# EAGLE schematic Termo3 (EAGLE 6.2)
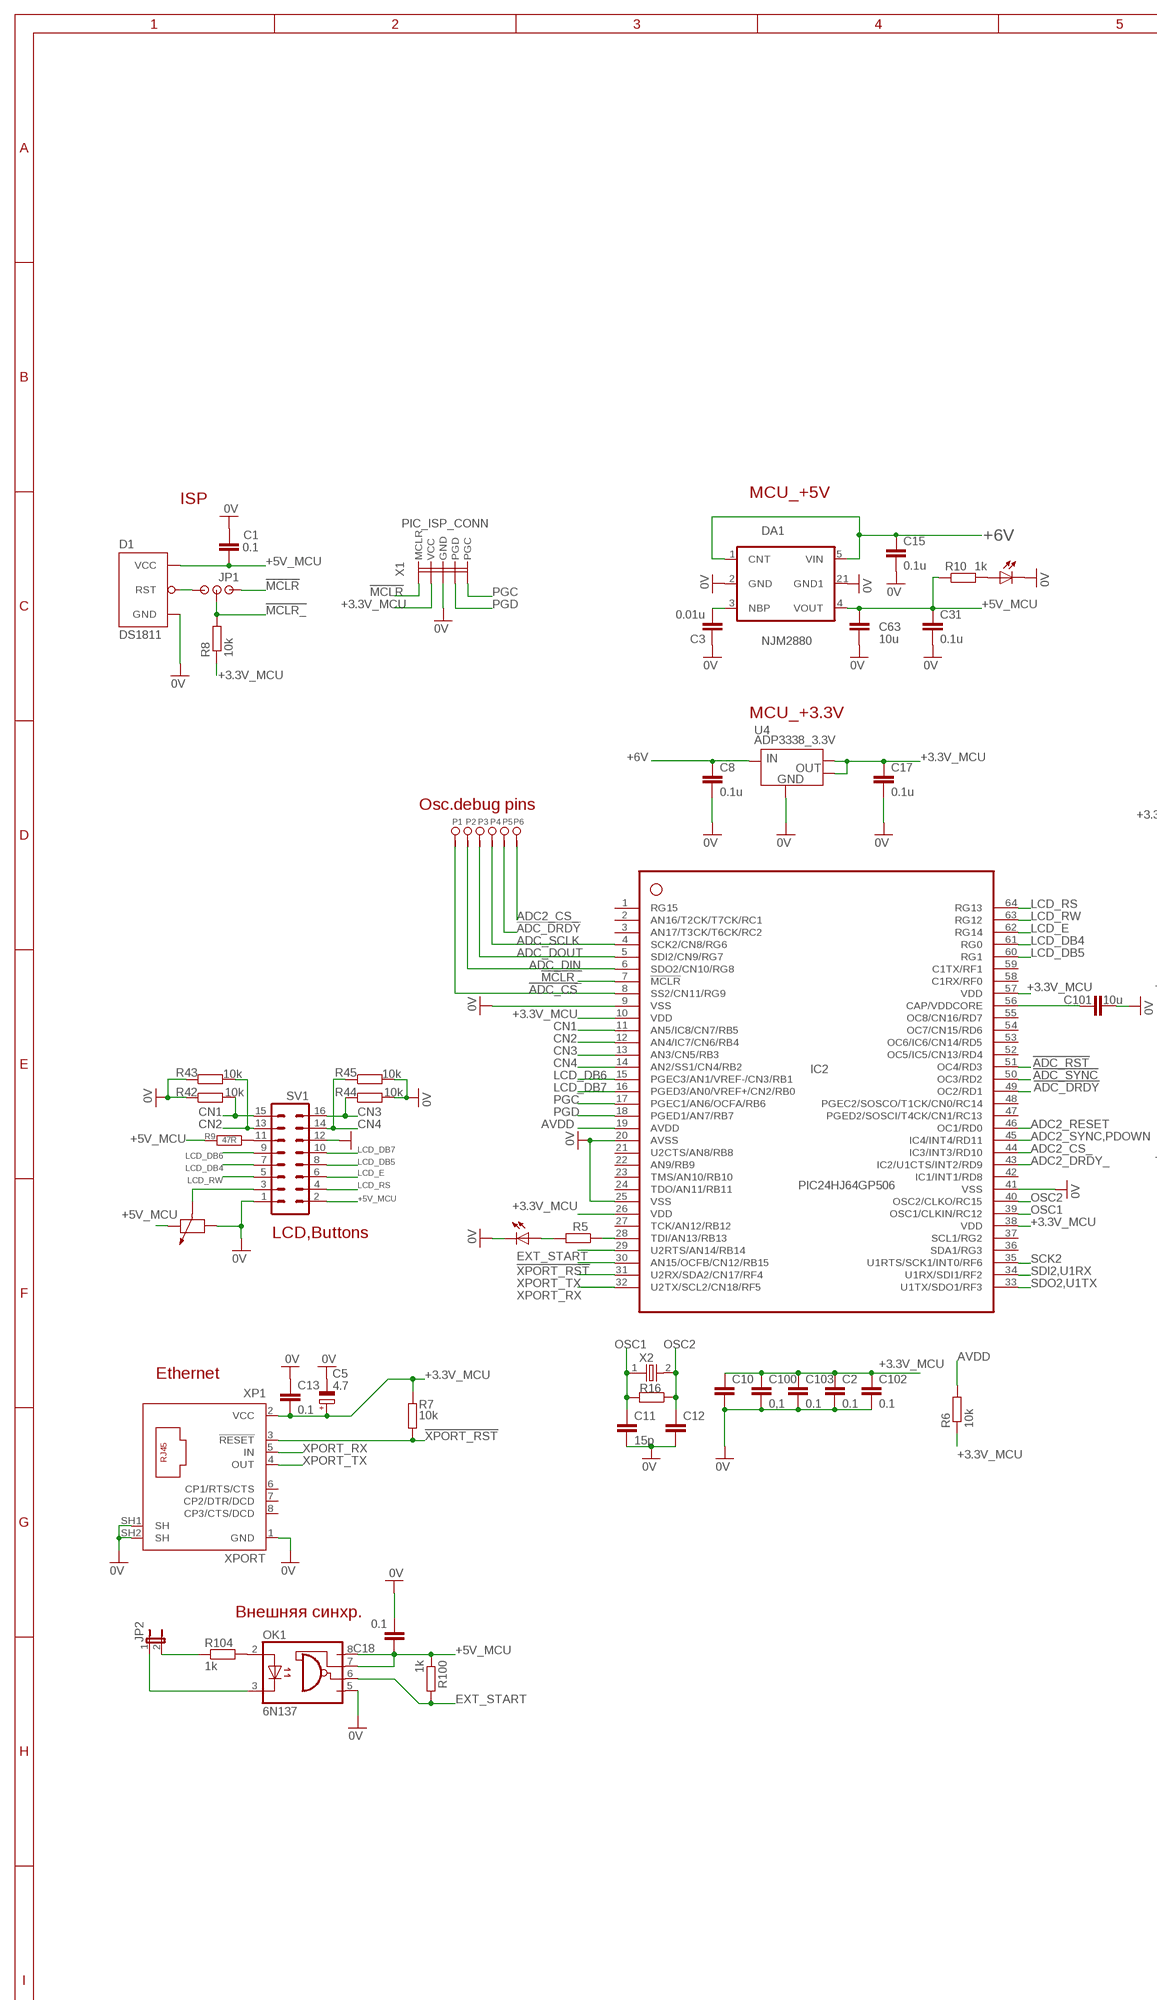
[diagram p0: schematic, sheet 1, part 1 of 2]
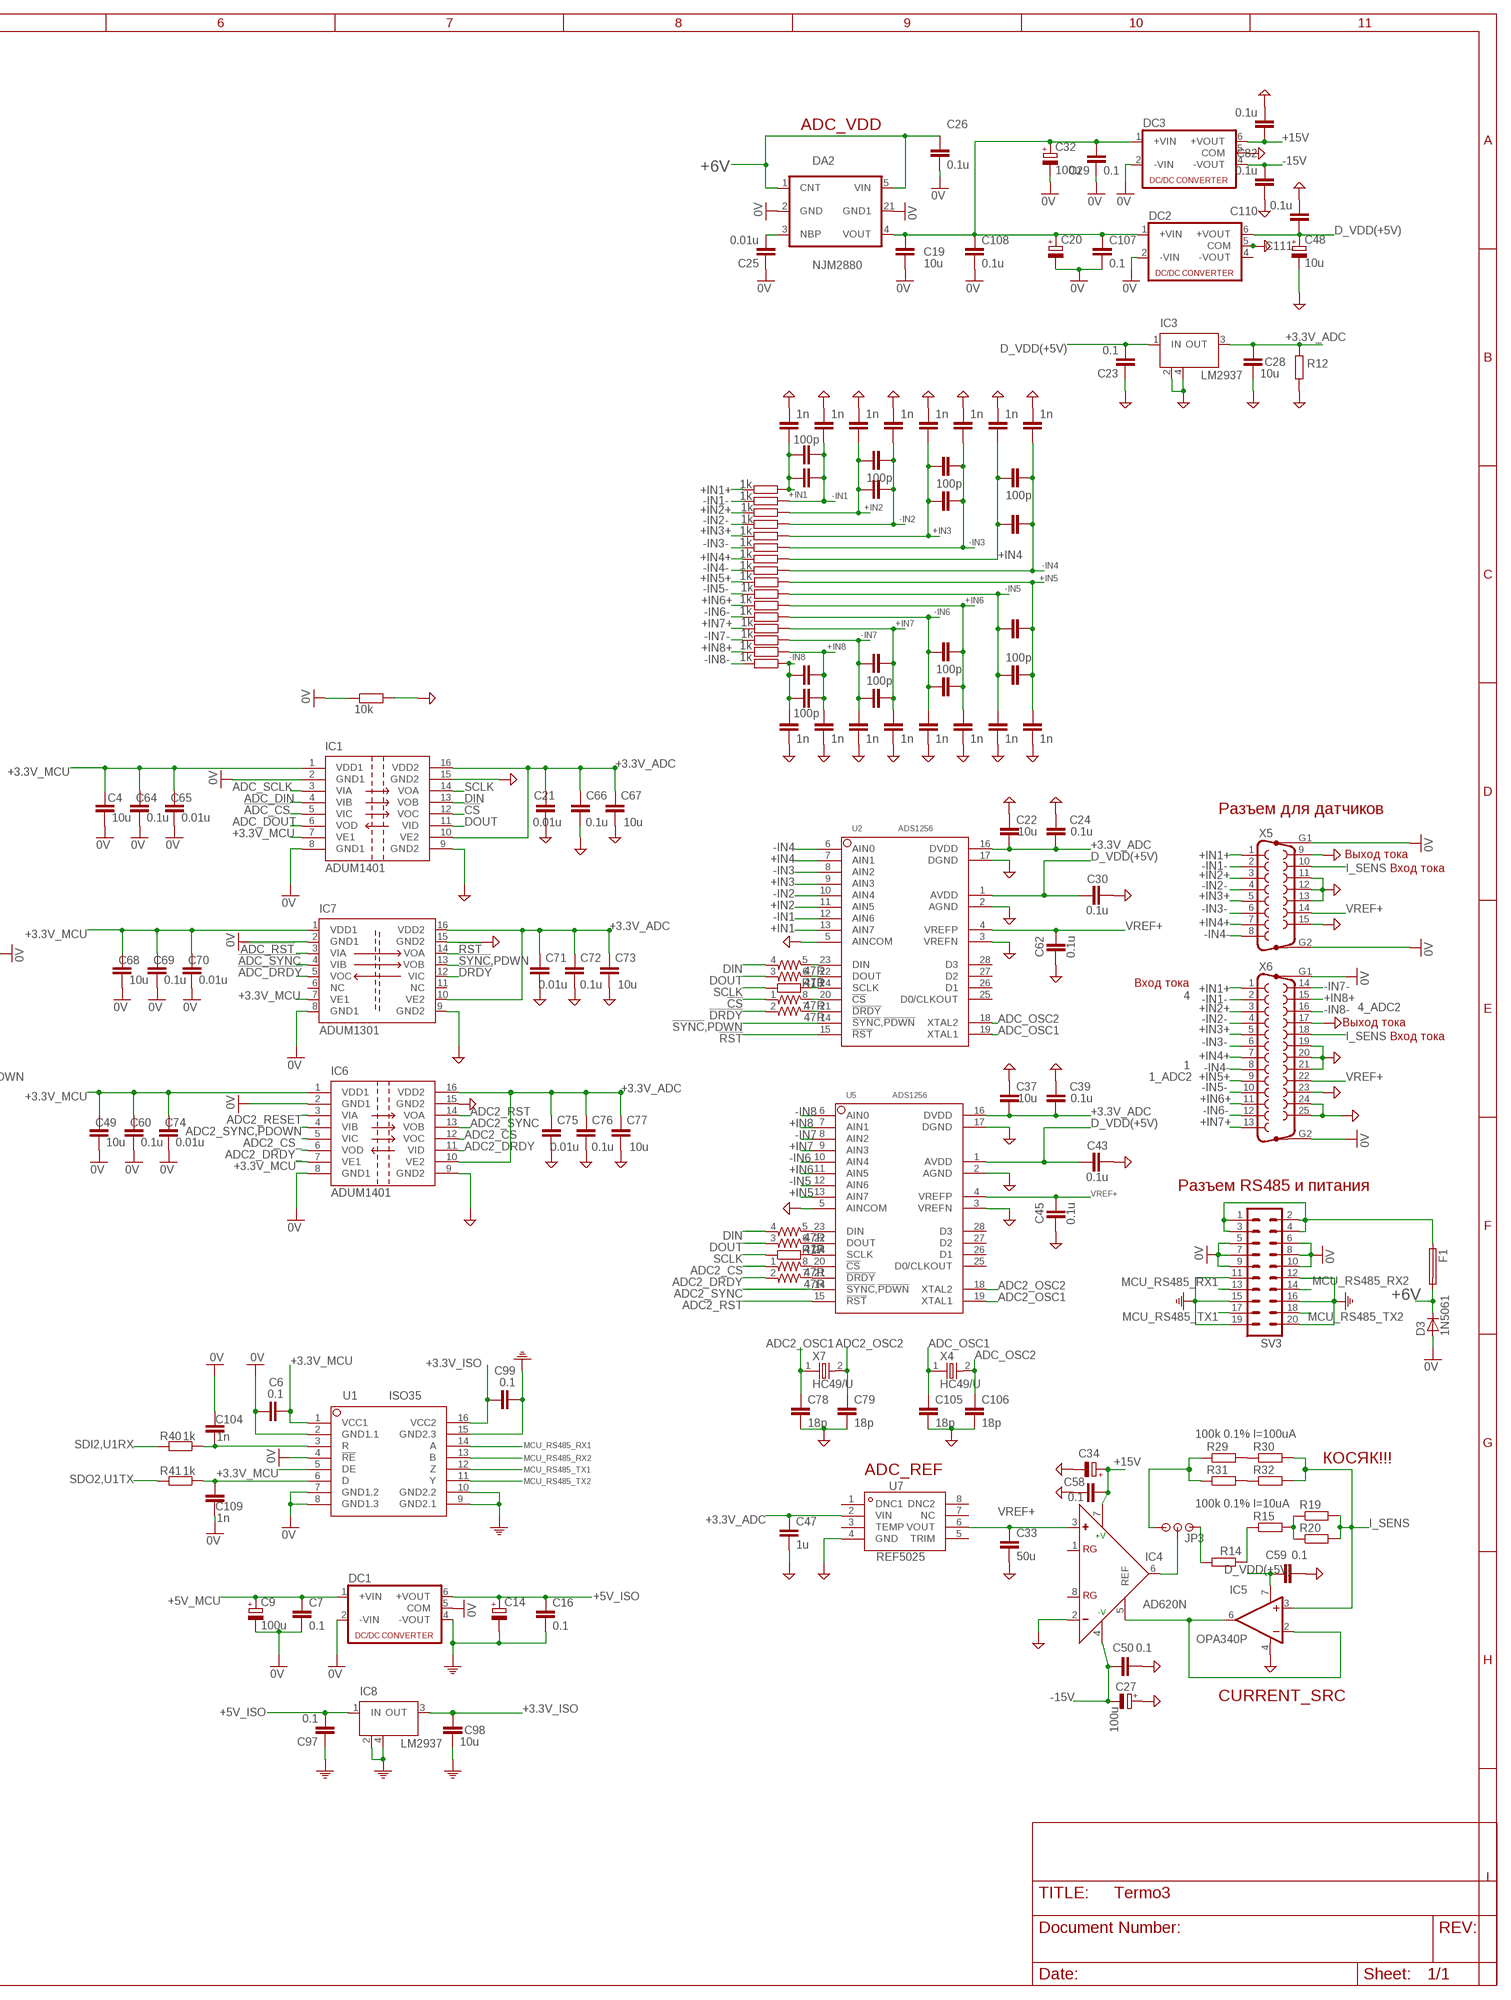
[diagram p1: schematic, sheet 1, part 2 of 2]

## Parts
C1  0.1  C0805  [C0805D]
C2  0.1  C0805  [C0805D]
C3  0.01u  C0805  [C0805D]
C4  10u  C0805  [C0805D]
C5  4.7  C100MFX25V  [C100MILX6X12]
C6  0.1  C0805  [C0805D]
C7  0.1  C0805  [C0805D]
C8  0.1u  C0805  [C0805D]
C9  100u  C100MFX25V  [C100MILX6X12]
C10  C0805  [C0805D]
C11  15p  C0805  [C0805D]
C12  C0805  [C0805D]
C13  0.1  C0805  [C0805D]
C14  C100MFX25V  [C100MILX6X12]
C15  0.1u  C0805  [C0805D]
C16  0.1  C0805  [C0805D]
C17  0.1u  C0805  [C0805D]
C18  0.1  C0805  [C0805D]
C19  10u  C0805  [C0805D]
C20  C100MFX25V  [C100MILX6X12]
C21  0.01u  C0805  [C0805D]
C22  10u  C0805  [C0805D]
C23  0.1  C0805  [C0805D]
C24  0.1u  C0805  [C0805D]
C25  0.01u  C0805  [C0805D]
C26  0.1u  C0805  [C0805D]
C27  100u  C100MFX25V  [C100MILX6X12]
C28  10u  C0805  [C0805D]
C29  0.1  C0805  [C0805D]
C30  0.1u  C0805  [C0805D]
C31  0.1u  C0805  [C0805D]
C32  100u  C100MFX25V  [C100MILX6X12]
C33  50u  C0805  [C0805D]
C34  C100MFX25V  [C100MILX6X12]
C35  100p  C0805  [C0805D]
C36  100p  C0805  [C0805D]
C37  10u  C0805  [C0805D]
C38  100p  C0805  [C0805D]
C39  0.1u  C0805  [C0805D]
C40  100p  C0805  [C0805D]
C41  1n  C0805  [C0805D]
C42  1n  C0805  [C0805D]
C43  0.1u  C0805  [C0805D]
C44  1n  C0805  [C0805D]
C45  0.1u  C0805  [C0805D]
C46  1n  C0805  [C0805D]
C47  1u  C0805  [C0805D]
C48  10u  C100MFX25V  [C100MILX6X12]
C49  10u  C0805  [C0805D]
C50  0.1  C0805  [C0805D]
C51  1n  C0805  [C0805D]
C52  1n  C0805  [C0805D]
C53  1n  C0805  [C0805D]
C54  1n  C0805  [C0805D]
C55  1n  C0805  [C0805D]
C56  1n  C0805  [C0805D]
C57  1n  C0805  [C0805D]
C58  0.1  C0805  [C0805D]
C59  0.1  C0805  [C0805D]
C60  0.1u  C0805  [C0805D]
C61  1n  C0805  [C0805D]
C62  0.1u  C0805  [C0805D]
C63  10u  C0805  [C0805D]
C64  0.1u  C0805  [C0805D]
C65  0.01u  C0805  [C0805D]
C66  0.1u  C0805  [C0805D]
C67  10u  C0805  [C0805D]
C68  10u  C0805  [C0805D]
C69  0.1u  C0805  [C0805D]
C70  0.01u  C0805  [C0805D]
C71  0.01u  C0805  [C0805D]
C72  0.1u  C0805  [C0805D]
C73  10u  C0805  [C0805D]
C74  0.01u  C0805  [C0805D]
C75  0.01u  C0805  [C0805D]
C76  0.1u  C0805  [C0805D]
C77  10u  C0805  [C0805D]
C78  18p  C0805  [C0805D]
C79  18p  C0805  [C0805D]
C80  1n  C0805  [C0805D]
C81  1n  C0805  [C0805D]
C82  0.1u  C0805  [C0805D]
C83  1n  C0805  [C0805D]
C84  1n  C0805  [C0805D]
C85  1n  C0805  [C0805D]
C86  1n  C0805  [C0805D]
C87  1n  C0805  [C0805D]
C88  1n  C0805  [C0805D]
C89  1n  C0805  [C0805D]
C90  100p  C0805  [C0805D]
C91  1n  C0805  [C0805D]
C92  1n  C0805  [C0805D]
C93  1n  C0805  [C0805D]
C94  100p  C0805  [C0805D]
C95  100p  C0805  [C0805D]
C96  100p  C0805  [C0805D]
C97  0.1  C0805  [C0805D]
C98  10u  C0805  [C0805D]
C99  0.1  C0805  [C0805D]
C100  0,1  C0805  [C0805D]
C101  10u  C0805  [C0805D]
C102  0.1  C0805  [C0805D]
C103  0.1  C0805  [C0805D]
C104  1n  C0805  [C0805D]
C105  18p  C0805  [C0805D]
C106  18p  C0805  [C0805D]
C107  0.1  C0805  [C0805D]
C108  0.1u  C0805  [C0805D]
C109  1n  C0805  [C0805D]
C110  0.1u  C0805  [C0805D]
C111  0.1u  C0805  [C0805D]
D1  DS1811  [TO92-60]
D3  1N5061  [DO41-10]
DA1  NJM2880  [SOT89-5]
DA2  NJM2880  [SOT89-5]
DC1  NMA  [NMA]
DC2  NMA  [NMA]
DC3  NMA  [NMA]
F1  TE5  [TE5]
HL2  LED3MM  [LED3MM]
HL6  LED3MM  [LED3MM]
IC1  ADUM1401  [SO16W]
IC2  PIC24HJ64GP506  [TQFP64-10X10]
IC3  LM2937  [SOT223]
IC4  AD620N  [DIL08]
IC5  OPA340P  [DIL08]
IC6  ADUM1401  [SO16W]
IC7  ADUM1301  [SO-16W]
IC8  LM2937  [SOT223]
JP1  JP3PIN  [PLC-3PIN]
JP2  JP1E  [JP1]
JP3  JP3PIN  [PLC-3PIN]
OK1  6N137  [DIL08]
P1  1_PIN_CON  [1_PIN_CON]
P2  1_PIN_CON  [1_PIN_CON]
P3  1_PIN_CON  [1_PIN_CON]
P4  1_PIN_CON  [1_PIN_CON]
P5  1_PIN_CON  [1_PIN_CON]
P6  1_PIN_CON  [1_PIN_CON]
POT1  RTRIM3329H  [RTRIM3329H]
R5  51R  R0805  [R0805D]
R6  10k  R0805  [R0805D]
R7  10k  R0805  [R0805D]
R8  10k  R0805  [R0805D]
R9  47R  MLT025"  [0207/10]
R10  1k  R0805  [R0805D]
R11  10k  R0805  [R0805D]
R12  1k  R0805  [R0805D]
R13  51R  R0805  [R0805D]
R14  MLT025"  [0207/10]
R15  100k 0.1% I=10uA  MLT025"  [0207/10]
R16  1M  R0805  [R0805D]
R17  51R  R0805  [R0805D]
R18  1k  R0805  [R0805D]
R19  MLT025"  [0207/10]
R20  MLT025"  [0207/10]
R21  1k  R0805  [R0805D]
R22  1k  R0805  [R0805D]
R23  1k  R0805  [R0805D]
R24  1k  R0805  [R0805D]
R25  1k  R0805  [R0805D]
R26  1k  R0805  [R0805D]
R27  1k  R0805  [R0805D]
R28  1k  R0805  [R0805D]
R29  100k 0.1% I=100uA  MLT025"  [0207/10]
R30  MLT025"  [0207/10]
R31  MLT025"  [0207/10]
R32  MLT025"  [0207/10]
R33  1k  R0805  [R0805D]
R34  1k  R0805  [R0805D]
R35  1k  R0805  [R0805D]
R36  1k  R0805  [R0805D]
R37  1k  R0805  [R0805D]
R38  1k  R0805  [R0805D]
R39  1k  R0805  [R0805D]
R40  1k  R0805  [R0805D]
R41  1k  R0805  [R0805D]
R42  10k  R0805  [R0805D]
R43  10k  R0805  [R0805D]
R44  10k  R0805  [R0805D]
R45  10k  R0805  [R0805D]
R100  1k  R0805  [R0805D]
R104  1k  R0805  [R0805D]
RN1  47R  742-8_SNS  [742-8NS]
RN2  47R  742-8_SNS  [742-8NS]
SV1  ML16  [ML16]
SV3  ML20L  [ML20L]
U1  ISO35  [ISO35_SOIC16]
U2  ADS1256  [PCM2705-TSSOP28]
U4  ADP3338_3.3V  [SOT223]
U5  ADS1256  [PCM2705-TSSOP28]
U7  REF5025  [SO08]
X1  PIC_ISP_CONN  [PLC-5PIN]
X2  10MEG  HC49/U  [HC49U-V]
X4  HC49/U  [HC49U-V]
X5  F15HP  [F15HP]
X6  F25HP  [F25HP]
X7  HC49/U  [HC49U-V]
XP1  XPORT  [XPORT]

## Nets
0V: C1.2 C2.2 C3.1 C4.2 C5.MINUS(-) C6.1 C7.2 C8.2 C9.MINUS(-) C10.2 C11.2 C12.2 C13.1 C15.2 C17.2 C18.2 C19.1 C20.MINUS(-) C25.1 C26.2 C29.1 C31.2 C32.MINUS(-) C49.2 C60.2 C63.1 C64.2 C65.2 C68.2 C69.2 C70.2 C74.2 C100.2 C101.2 C102.2 C103.2 C104.1 C107.2 C108.2 C109.2 D1.3(GND) D3.A DA1.2(GND) DA1.21(GND1) DA2.2(GND) DA2.21(GND1) DC1.2(-VIN) DC1.5(COM) DC2.2(-VIN) DC3.2(-VIN) HL2.K(C) HL6.K(C) IC1.2(GND1) IC1.8(GND1) IC2.9(VSS) IC2.20(AVSS) IC2.25(VSS) IC2.41(VSS) IC6.2(GND1) IC6.8(GND1) IC7.2(GND1) IC7.8(GND1) OK1.5(GND) POT1.1 R11.P$1 R42.P$1 R43.P$1 R44.P$2 R45.P$2 SV1.1 SV1.12 SV3.5 SV3.6 SV3.7 SV3.8 SV3.9 SV3.10 U1.2(GND1.1) U1.4(!RE) U1.7(GND1.2) U1.8(GND1.3) U4.1 X1.P$3(GND) X5.G1 X5.G2 X6.G1 X6.G2 XP1.1(GND) XP1.SH1(SH) XP1.SH2(SH)
!ADC_CS: IC1.5(VIC) IC2.8(SS2/CN11/RG9) P1.P$1
!ADC_DRDY: IC2.49(OC2/RD1) IC7.5(VOC) P5.P$1
!ADC_RST: IC2.51(OC4/RD3) IC7.3(VIA)
!ADC_SYNC: IC2.50(OC3/RD2) IC7.4(VIB)
!CS: IC1.12(VOC) RN1.1
!DRDY: IC7.12(VIC) RN1.2
!MCLR: JP1.P$1 X1.P$1(MCLR)
!MCLR_: IC2.7(!MCLR) JP1.P$2 R8.P$2
!RST: IC7.14(VOA) U2.15(!RST)
!SYNC,PDWN: IC7.13(VOB) U2.14(!SYNC,!PDWN)
!XPORT_RST: IC2.30(AN15/OCFB/CN12/RB15) R7.P$2 XP1.3(!RESET)
+3.3V_ADC: C21.2 C22.2 C24.1 C28.2 C37.2 C39.1 C47.1 C66.2 C67.2 C71.2 C72.2 C73.2 C75.2 C76.2 C77.2 IC1.10(VE2) IC1.16(VDD2) IC3.3(OUT) IC6.10(VE2) IC6.16(VDD2) IC7.10(VE2) IC7.16(VDD2) R12.P$2 U2.16(DVDD) U5.16(DVDD) U7.2(VIN)
+3.3V_ISO: C98.2 C99.1 IC8.3(OUT) U1.16(VCC2)
+3.3V_MCU: C2.1 C4.1 C5.PLUS(+) C6.2 C10.1 C13.2 C17.1 C49.1 C60.1 C64.1 C65.1 C68.1 C69.1 C70.1 C74.1 C100.1 C102.1 C103.1 IC1.1(VDD1) IC1.7(VE1) IC2.10(VDD) IC2.26(VDD) IC2.38(VDD) IC2.57(VDD) IC6.1(VDD1) IC6.7(VE1) IC7.1(VDD1) IC7.7(VE1) R6.P$1 R7.P$1 R8.P$1 U1.1(VCC1) U1.5(DE) U4.2 U4.4(2.) X1.P$2(VCC) XP1.2(VCC)
+5V_ISO: C14.PLUS(+) C16.1 C97.2 DC1.6(+VOUT) IC8.1(IN)
+5V_MCU: C1.1 C7.1 C9.PLUS(+) C18.1 C31.1 C63.2 D1.2(VCC) DA1.4(VOUT) DC1.1(+VIN) OK1.7(VE) OK1.8(VCC) POT1.2 R9.2 R10.P$1 R100.P$1 SV1.2
+6V: C8.1 C15.1 C26.1 D3.C DA1.1(CNT) DA1.5(VIN) DA2.1(CNT) DA2.5(VIN) F1.2 U4.3
+15V: C34.PLUS(+) C58.2 C82.1 DC3.6(+VOUT) IC4.7(+V)
+IN1: C35.1 C41.1 C51.1 R22.P$1 U2.13(AIN7)
+IN1+: R22.P$2 X5.1 X6.1
+IN2: C40.1 C46.1 C57.1 R28.P$1 U2.11(AIN5)
+IN2+: R28.P$2 X5.3 X6.3
+IN3: C38.1 C44.1 C55.1 R26.P$1 U2.9(AIN3)
+IN3+: R26.P$2 X5.5 X6.5
+IN4: C36.1 C42.1 C53.1 R24.P$1 U2.7(AIN1)
+IN4+: R24.P$2 X5.7 X6.7
+IN5: C86.1 C91.2 C94.2 R35.P$1 U5.13(AIN7)
+IN5+: R35.P$2 X6.9
+IN6: C84.1 C92.2 C95.2 R33.P$1 U5.11(AIN5)
+IN6+: R33.P$2 X6.11
+IN7: C81.1 C89.2 C96.2 R18.P$1 U5.9(AIN3)
+IN7+: R18.P$2 X6.13
+IN8: C87.1 C90.2 C93.2 R38.P$1 U5.7(AIN1)
+IN8+: R38.P$2 X6.15
-15V: C27.MINUS(-) C50.2 C110.2 DC3.4(-VOUT) IC4.4(-V)
-IN1: C35.2 C41.2 C61.1 R21.P$1 U2.12(AIN6)
-IN1-: R21.P$2 X5.2 X6.2
-IN2: C40.2 C46.2 C56.1 R27.P$1 U2.10(AIN4)
-IN2-: R27.P$2 X5.4 X6.4
-IN3: C38.2 C44.2 C54.1 R25.P$1 U2.8(AIN2)
-IN3-: R25.P$2 X5.6 X6.6
-IN4: C36.2 C42.2 C52.1 R23.P$1 U2.6(AIN0)
-IN4-: R23.P$2 X5.8 X6.8
-IN5: C85.1 C91.1 C94.1 R34.P$1 U5.12(AIN6)
-IN5-: R34.P$2 X6.10
-IN6: C83.1 C92.1 C95.1 R36.P$1 U5.10(AIN4)
-IN6-: R36.P$2 X6.12
-IN7: C80.1 C89.1 C96.1 R37.P$1 U5.8(AIN2)
-IN7-: R37.P$2 X6.14
-IN8: C88.1 C90.1 C93.1 R39.P$1 U5.6(AIN0)
-IN8-: R39.P$2 X6.16
ADC2_CS: IC6.12(VOC) RN2.1
ADC2_CS_: IC2.44(IC3/INT3/RD10) IC6.5(VIC) P6.P$1
ADC2_DRDY: IC6.11(VID) RN2.2
ADC2_DRDY_: IC2.43(IC2/U1CTS/INT2/RD9) IC6.6(VOD)
ADC2_OSC1: C78.1 U5.19(XTAL1) X7.1
ADC2_OSC2: C79.1 U5.18(XTAL2) X7.2
ADC2_RESET: IC2.46(OC1/RD0) IC6.3(VIA)
ADC2_RST: IC6.14(VOA) U5.15(!RST)
ADC2_SYNC: IC6.13(VOB) U5.14(!SYNC,!PDWN)
ADC2_SYNC,PDOWN: IC2.45(IC4/INT4/RD11) IC6.4(VIB)
ADC_AVDD: C19.2 C20.PLUS(+) C29.2 C32.PLUS(+) C107.1 C108.1 DA2.4(VOUT) DC2.1(+VIN) DC3.1(+VIN)
ADC_DIN: IC1.4(VIB) IC2.6(SDO2/CN10/RG8) P2.P$1
ADC_DOUT: IC1.6(VOD) IC2.5(SDI2/CN9/RG7) P3.P$1
ADC_OSC1: C105.1 U2.19(XTAL1) X4.1
ADC_OSC2: C106.1 U2.18(XTAL2) X4.2
ADC_SCLK: IC1.3(VIA) IC2.4(SCK2/CN8/RG6) P4.P$1
AVDD: IC2.19(AVDD) R6.P$2
CN1: IC2.11(AN5/IC8/CN7/RB5) R42.P$2 SV1.15
CN2: IC2.12(AN4/IC7/CN6/RB4) R43.P$2 SV1.13
CN3: IC2.13(AN3/CN5/RB3) R44.P$1 SV1.16
CN4: IC2.14(AN2/SS1/CN4/RB2) R45.P$1 SV1.14
D_VDD(+5V): C23.2 C30.1 C43.1 C48.PLUS(+) C59.1 C111.1 DC2.6(+VOUT) IC3.1(IN) IC5.7(V+) U2.1(AVDD) U5.1(AVDD)
DGND: C21.1 C22.1 C23.1 C24.2 C27.PLUS(+) C28.1 C30.2 C33.2 C34.MINUS(-) C37.1 C39.2 C43.2 C45.1 C47.2 C48.MINUS(-) C50.1 C51.2 C52.2 C53.2 C54.2 C55.2 C56.2 C57.2 C58.1 C59.2 C61.2 C62.1 C66.1 C67.1 C71.1 C72.1 C73.1 C75.1 C76.1 C77.1 C78.2 C79.2 C80.2 C81.2 C82.2 C83.2 C84.2 C85.2 C86.2 C87.2 C88.2 C105.2 C106.2 C110.1 C111.2 DC2.5(COM) DC3.5(COM) IC1.9(GND2) IC1.15(GND2) IC3.2(GND) IC3.4(GND) IC4.2(-) IC5.4(V-) IC6.9(GND2) IC6.15(GND2) IC7.9(GND2) IC7.15(GND2) R11.P$2 R12.P$1 U2.2(AGND) U2.3(VREFN) U2.5(AINCOM) U2.17(DGND) U5.2(AGND) U5.3(VREFN) U5.5(AINCOM) U5.17(DGND) U7.4(GND) X5.9 X5.11 X5.12 X5.13 X5.15 X6.17 X6.19 X6.20 X6.21 X6.23 X6.24 X6.25
DIN: IC1.13(VOB) RN1.4 RN2.4
DOUT: IC1.11(VID) RN1.3 RN2.3
EXT_START: IC2.29(U2RTS/AN14/RB14) OK1.6(VO) R100.P$2
I_SENS: IC5.3(+IN) R19.2 R20.2 R30.2 R32.2 X5.10 X6.18
LCD_DB4: IC2.61(RG0) SV1.7
LCD_DB5: IC2.60(RG1) SV1.8
LCD_DB6: IC2.15(PGEC3/AN1/VREF-/CN3/RB1) SV1.9
LCD_DB7: IC2.16(PGED3/AN0/VREF+/CN2/RB0) SV1.10
LCD_E: IC2.62(RG14) SV1.6
LCD_RS: IC2.64(RG13) SV1.4
LCD_RW: IC2.63(RG12) SV1.5
MCU_RS485_RX1: SV3.13 U1.14(A)
MCU_RS485_RX2: SV3.14 U1.13(B)
MCU_RS485_TX1: SV3.17 U1.12(Z)
MCU_RS485_TX2: SV3.18 U1.11(Y)
N$1: C101.1 IC2.56(CAP/VDDCORE)
N$2: D1.1(RST) JP1.P$3
N$3: RN1.8 U2.20(!CS)
N$4: RN1.7 U2.21(!DRDY)
N$5: RN1.6 U2.22(DOUT)
N$6: RN1.5 U2.23(DIN)
N$7: R13.P$2 U2.24(SCLK)
N$8: C3.2 DA1.3(NBP)
N$9: POT1.3 SV1.3
N$10: RN2.8 U5.20(!CS)
N$12: IC4.5(REF) IC5.2(-IN) IC5.6(OUT)
N$13: F1.1 SV3.1 SV3.2 SV3.3 SV3.4
N$14: C25.2 DA2.3(NBP)
N$15: RN2.7 U5.21(!DRDY)
N$16: RN2.6 U5.22(DOUT)
N$17: IC4.6(OUT) JP3.P$2
N$18: R9.1 SV1.11
N$19: HL6.A R10.P$2
N$20: IC2.28(TDI/AN13/RB13) R5.P$1
N$21: HL2.A R5.P$2
N$24: JP2.1 OK1.3(C)
N$25: RN2.5 U5.23(DIN)
N$27: R17.P$2 U5.24(SCLK)
N$33: R29.2 R30.1
N$34: R31.2 R32.1
N$35: JP3.P$3 R29.1 R31.1
N$37: JP3.P$1 R14.2
N$38: OK1.2(A) R104.P$2
N$39: JP2.2 R104.P$1
N$44: R14.1 R15.1
N$46: R15.2 R19.1 R20.1
N$56: C104.2 R40.P$1 U1.3(R)
N$57: C109.1 R41.P$1 U1.6(D)
OSC1: C11.1 IC2.39(OSC1/CLKIN/RC12) R16.P$2 X2.1
OSC2: C12.1 IC2.40(OSC2/CLKO/RC15) R16.P$1 X2.2
PE: C14.MINUS(-) C16.2 C97.1 C98.1 C99.2 DC1.4(-VOUT) IC8.2(GND) IC8.4(GND) SV3.11 SV3.12 SV3.15 SV3.16 SV3.19 SV3.20 U1.9(GND2.1) U1.10(GND2.2) U1.15(GND2.3)
PGC: IC2.17(PGEC1/AN6/OCFA/RB6) X1.P$5(PGC)
PGD: IC2.18(PGED1/AN7/RB7) X1.P$4(PGD)
SCK2: IC2.35(U1RTS/SCK1/INT0/RF6)
SCLK: IC1.14(VOA) R13.P$1 R17.P$1
SDI2,U1RX: IC2.34(U1RX/SDI1/RF2) R40.P$2
SDO2,U1TX: IC2.33(U1TX/SDO1/RF3) R41.P$2
VREF+: C33.1 C45.2 C62.2 IC4.3(+) U2.4(VREFP) U5.4(VREFP) U7.6(VOUT) X5.14 X6.22
XPORT_RX: IC2.32(U2TX/SCL2/CN18/RF5) XP1.5(IN)
XPORT_TX: IC2.31(U2RX/SDA2/CN17/RF4) XP1.4(OUT)
Unconnected: DC2.4(-VOUT) IC2.1(RG15) IC2.2(AN16/T2CK/T7CK/RC1) IC2.3(AN17/T3CK/T6CK/RC2) IC2.21(U2CTS/AN8/RB8) IC2.22(AN9/RB9) IC2.23(TMS/AN10/RB10) IC2.24(TDO/AN11/RB11) IC2.27(TCK/AN12/RB12) IC2.36(SDA1/RG3) IC2.37(SCL1/RG2) IC2.42(IC1/INT1/RD8) IC2.47(PGED2/SOSCI/T4CK/CN1/RC13) IC2.48(PGEC2/SOSCO/T1CK/CN0/RC14) IC2.52(OC5/IC5/CN13/RD4) IC2.53(OC6/IC6/CN14/RD5) IC2.54(OC7/CN15/RD6) IC2.55(OC8/CN16/RD7) IC2.58(C1RX/RF0) IC2.59(C1TX/RF1) IC4.1(RG) IC4.8(RG) IC7.6(NC) IC7.11(NC) U2.25(D0/CLKOUT) U2.26(D1) U2.27(D2) U2.28(D3) U5.25(D0/CLKOUT) U5.26(D1) U5.27(D2) U5.28(D3) U7.1(DNC1) U7.3(TEMP) U7.5(TRIM) U7.7(NC) U7.8(DNC2) XP1.6(CP1/RTS/CTS) XP1.7(CP2/DTR/DCD) XP1.8(CP3/CTS/DCD)

## Notes on the sheet
- ADC_VDD
- MCU_+5V
- ISP
- MCU_+3.3V
- Osc.debug pins
- Разъем для датчиков
- Выход тока
- Вход тока
- Вход тока
- 4
- 4_ADC2
- Выход тока
- Вход тока
- 1
- 1_ADC2
- LCD,Buttons
- Разъем RS485 и питания
- Ethernet
- КОСЯК!!!
- ADC_REF
- Внешняя синхр.
- CURRENT_SRC

## Library data of the parts
C1-C4 C6-C8 C10-C13 C15-C19 C21-C26 C28-C31 C33 C35-C47 C49-C111 = den:C0805
C5 C9 C14 C20 C27 C32 C34 C48 = den:C100MFX25V
D1 = den:DS1811
D3 = den:1N5061
DA1 DA2 = den:NJM2880
DC1-DC3 = dc-dc-converter:NMA: DC-DC CONVERTER; MF: C & D TECHNOLOGIES, INC; MPN: NMA0515SC; OC_FARNELL: 1021434; OC_NEWARK: 61K3064
F1 = fuse:TE5: FUSE Wickmann; OC_FARNELL: unknown; OC_NEWARK: unknown
HL2 HL6 = den:LED3MM
IC1 IC6 = Dmitry:ADUM1401
IC2 = Dmitry:PIC24HJ64GP506: PIC24HJ64GP506 edit this description Auto generated by make-symbol-device-package-bsdl.ulp Rev. 25 Source: PIC24HJ64GP506.bsd; MPN: PIC24HJ64GP506A-I/PT; OC_FARNELL: 1146551; OC_NEWARK: 45P4882
IC3 IC8 = Dmitry:LM2937: 3-Terminal Positive Regulators
IC4 = analog-devices:AD620: Low Cost, Low Power, Instrumentation Amplifier Source: http://www.analog.com/UploadedFiles/Data_Sheets/37793330023930AD620_e.pdf; MF: ALTERA CORPORATION; MPN: AD620AN; OC_FARNELL: 1523782; OC_NEWARK: 05F7108
IC5 = burr-brown:OPA340: Rail-to-Rail Operational Amplifiers Single-Supply, MicroAmplifier(TM) Series; MPN: OPA340PA; OC_FARNELL: 1097413; OC_NEWARK: 97K6826
IC7 = Dmitry:ADUM1301: Triple-Channel Digital Isolators Source: http://www.analog.com/static/imported-files/data_sheets/ADuM1300_1301.pdf; MPN: ADUM1301BRWZ; OC_FARNELL: 1465623; OC_NEWARK: 19M0757
JP1 JP3 = den:JP3PIN
JP2 = jumper:JP1E: JUMPER
OK1 = optocoupler:6N137: MOTOROLA OPTO COUPLER; MPN: 6N137; OC_FARNELL: 1328376; OC_NEWARK: 52M1895
P1-P6 = Dmitry:1_PIN_CON
POT1 = Dmitry:RTRIM3329H
R5-R8 R10-R13 R16-R18 R21-R28 R33-R45 R100 R104 = den:R0805
R9 R14 R15 R19 R20 R29-R32 = den:MLT025
RN1 RN2 = resistor-array:742-8_S: CTS 742 Series 8 Terminations, 4 Resistors
SV1 = con-harting-ml:ML16: HARTING; OC_FARNELL: unknown; OC_NEWARK: unknown
SV3 = con-harting-ml:ML20: HARTING; OC_FARNELL: unknown; OC_NEWARK: unknown
U1 = Dmitry:ISO35: RS485
U2 U5 = Dmitry:ADS1256: TI ADS1256 - 24 bit delta sigma ADC TSSOP28 PAC
U4 = Dmitry:ADP3338_3.3V
U7 = Dmitry:REF5025
X1 = den:PIC_ISP_CONN
X2 X4 X7 = den:HC49/U
X5 = con-subd:F15HP: SUB-D; OC_FARNELL: unknown; OC_NEWARK: unknown
X6 = con-subd:F25HP: SUB-D; OC_FARNELL: unknown; OC_NEWARK: unknown
XP1 = lantronix:XPORT: Serial to 10/100 Ethernet transceiver Source: http://www.lantronix.com/pdf/XPort_DS.pdf; OC_FARNELL: unknown; OC_NEWARK: unknown